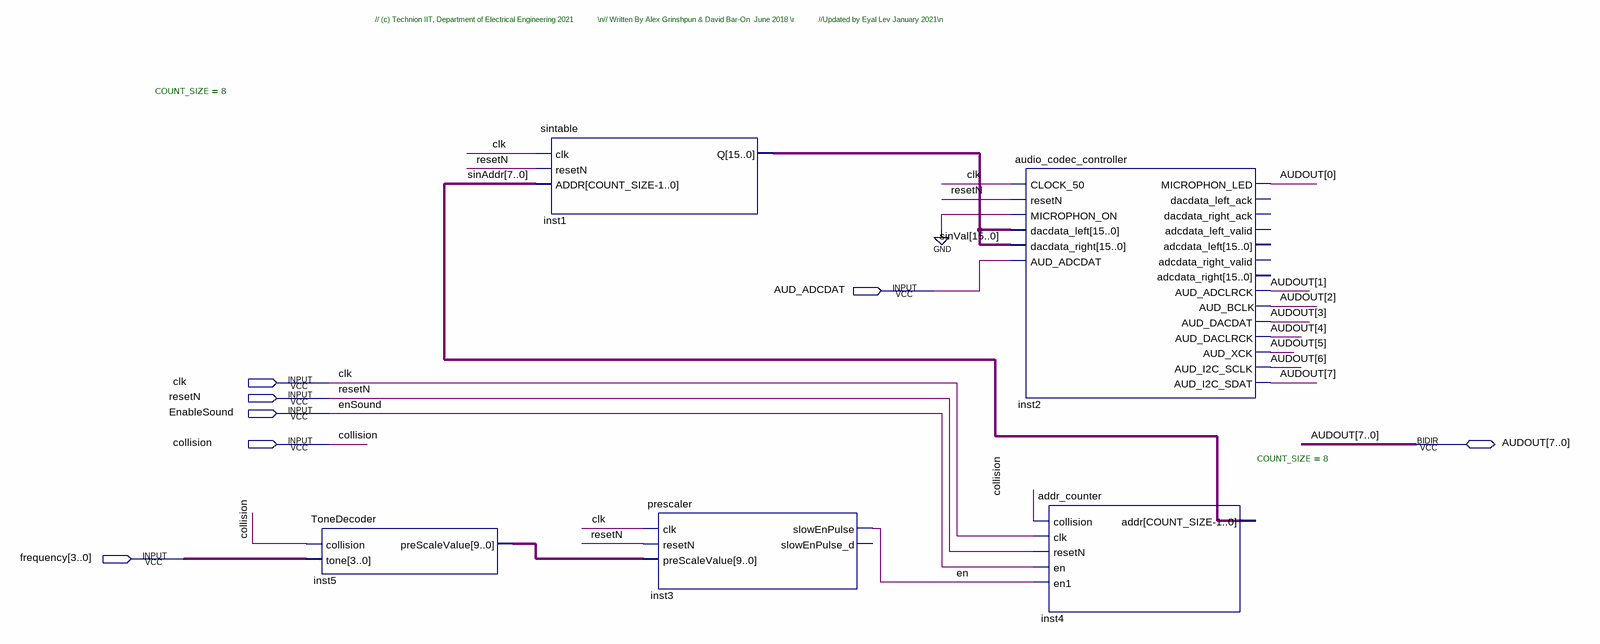
[diagram p0: schematic sheet]
// Quartus schematic AUDIO.bdf as structural Verilog: 5 symbols, 7 pins
module AUDIO (
  input  AUD_ADCDAT,
  input  clk,
  input  resetN,
  input  EnableSound,
  input  collision,
  input  [3:0] frequency,
  inout  [7:0] AUDOUT
);

  wire en;
  wire [7:0] sinAddr;
  wire [9:0] inst5_prescalevalue;
  wire [15:0] sinVal;

  ToneDecoder inst5 (.collision(collision), .tone(frequency), .preScaleValue(inst5_prescalevalue));
  sintable #(.COUNT_SIZE(8)) inst1 (.clk(clk), .resetN(resetN), .ADDR(sinAddr), .Q(sinVal));
  prescaler inst3 (
    .clk(clk), .resetN(resetN), .preScaleValue(inst5_prescalevalue), .slowEnPulse(en));  // open: slowEnPulse_d
  audio_codec_controller inst2 (
    .CLOCK_50(clk), .resetN(resetN), .MICROPHON_ON(1'b0), .dacdata_left(sinVal), .dacdata_right(sinVal),
    .AUD_ADCDAT(AUD_ADCDAT), .MICROPHON_LED(AUDOUT[0]), .AUD_DACDAT(AUDOUT[3]), .AUD_XCK(AUDOUT[5]),
    .AUD_I2C_SCLK(AUDOUT[6]), .AUD_ADCLRCK(AUDOUT[1]), .AUD_BCLK(AUDOUT[2]), .AUD_DACLRCK(AUDOUT[4]),
    .AUD_I2C_SDAT(AUDOUT[7]));  // open: dacdata_left_ack, dacdata_right_ack, adcdata_left_valid, adcdata_left, adcdata_right_valid, adcdata_right
  addr_counter #(.COUNT_SIZE(8)) inst4 (
    .collision(collision), .clk(clk), .resetN(resetN), .en(EnableSound), .en1(en), .addr(sinAddr));

  // Other names for the same wires on the sheet: enSound = EnableSound

  // Notes on the sheet:
  //   // (c) Technion IIT, Department of Electrical Engineering 2021            \n// Written By Alex Grinshpun & David Bar-On  June 2018 \r            //Updated by Eyal Lev January 2021\n
endmodule
